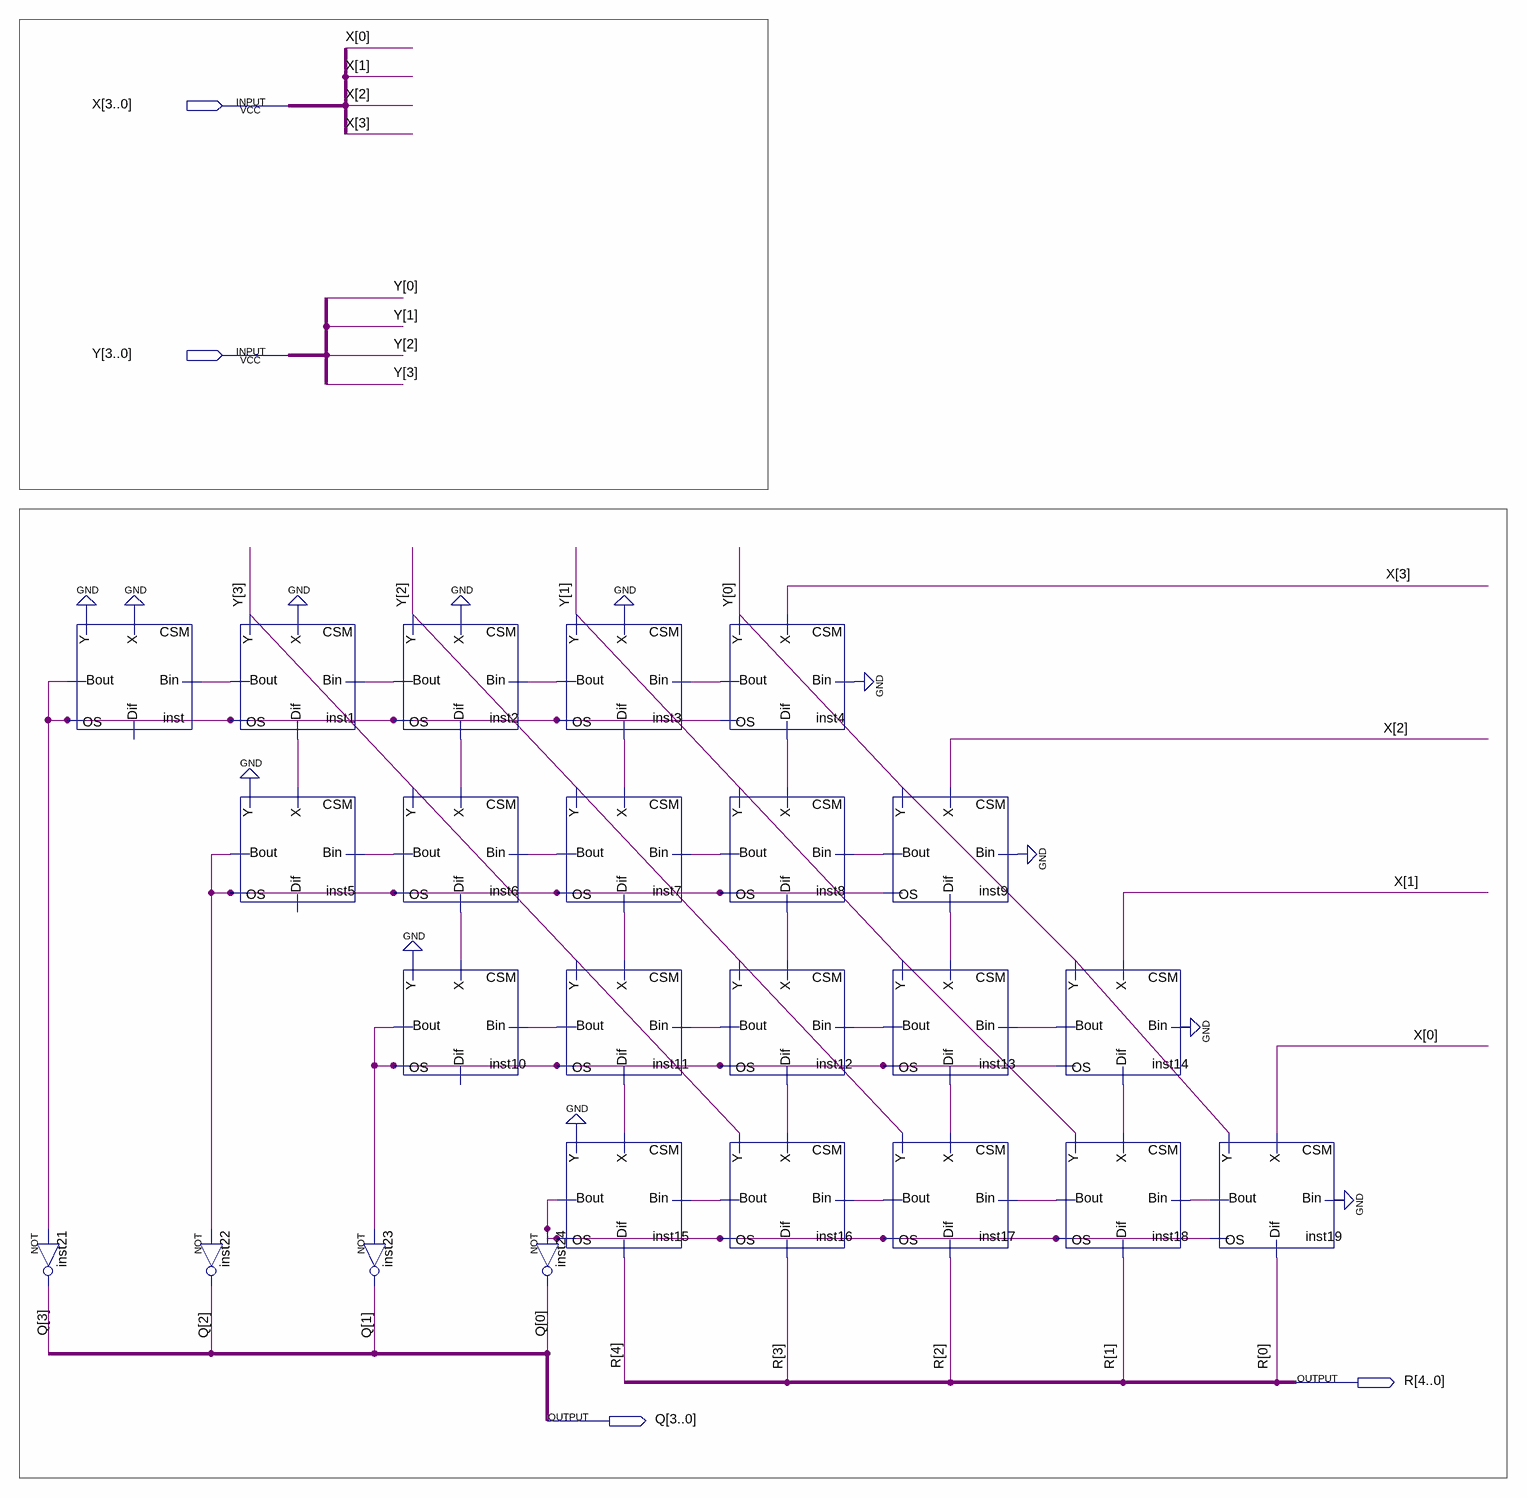
[diagram p0: schematic sheet]
// Quartus schematic divisor.bdf as structural Verilog: 24 symbols, 4 pins
module divisor (
  input  [3:0] X,
  input  [3:0] Y,
  output [4:0] R,
  output [3:0] Q
);

  wire inst1_bout, inst1_dif, inst2_bout, inst2_dif, inst3_bout, inst3_dif, inst4_bout, inst4_dif,
       inst5_bout, inst6_bout, inst6_dif, inst7_bout, inst7_dif, inst8_bout, inst8_dif, inst9_bout,
       inst9_dif, inst10_bout, inst11_bout, inst11_dif, inst12_bout, inst12_dif, inst13_bout, inst13_dif,
       inst14_bout, inst14_dif, inst15_bout, inst16_bout, inst17_bout, inst18_bout, inst19_bout, inst_bout;

  not inst21 (Q[3], inst_bout);
  CSM inst (.Y(1'b0), .X(1'b0), .Bin(inst1_bout), .OS(inst_bout), .Bout(inst_bout));  // open: Dif
  not inst22 (Q[2], inst5_bout);
  CSM inst1 (.Y(Y[3]), .X(1'b0), .Bin(inst2_bout), .OS(inst_bout), .Bout(inst1_bout), .Dif(inst1_dif));
  CSM inst5 (.Y(1'b0), .X(inst1_dif), .Bin(inst6_bout), .OS(inst5_bout), .Bout(inst5_bout));  // open: Dif
  not inst23 (Q[1], inst10_bout);
  CSM inst2 (.Y(Y[2]), .X(1'b0), .Bin(inst3_bout), .OS(inst_bout), .Bout(inst2_bout), .Dif(inst2_dif));
  CSM inst6 (.Y(Y[3]), .X(inst2_dif), .Bin(inst7_bout), .OS(inst5_bout), .Bout(inst6_bout), .Dif(inst6_dif));
  CSM inst10 (.Y(1'b0), .X(inst6_dif), .Bin(inst11_bout), .OS(inst10_bout), .Bout(inst10_bout));  // open: Dif
  CSM inst3 (.Y(Y[1]), .X(1'b0), .Bin(inst4_bout), .OS(inst_bout), .Bout(inst3_bout), .Dif(inst3_dif));
  CSM inst7 (.Y(Y[2]), .X(inst3_dif), .Bin(inst8_bout), .OS(inst5_bout), .Bout(inst7_bout), .Dif(inst7_dif));
  CSM inst11 (.Y(Y[3]), .X(inst7_dif), .Bin(inst12_bout), .OS(inst10_bout), .Bout(inst11_bout), .Dif(inst11_dif));
  CSM inst15 (.Y(1'b0), .X(inst11_dif), .Bin(inst16_bout), .OS(inst15_bout), .Bout(inst15_bout), .Dif(R[4]));
  not inst24 (Q[0], inst15_bout);
  CSM inst4 (.Y(Y[0]), .X(X[3]), .Bin(1'b0), .OS(inst_bout), .Bout(inst4_bout), .Dif(inst4_dif));
  CSM inst8 (.Y(Y[1]), .X(inst4_dif), .Bin(inst9_bout), .OS(inst5_bout), .Bout(inst8_bout), .Dif(inst8_dif));
  CSM inst12 (.Y(Y[2]), .X(inst8_dif), .Bin(inst13_bout), .OS(inst10_bout), .Bout(inst12_bout), .Dif(inst12_dif));
  CSM inst16 (.Y(Y[3]), .X(inst12_dif), .Bin(inst17_bout), .OS(inst15_bout), .Bout(inst16_bout), .Dif(R[3]));
  CSM inst9 (.Y(Y[0]), .X(X[2]), .Bin(1'b0), .OS(inst5_bout), .Bout(inst9_bout), .Dif(inst9_dif));
  CSM inst13 (.Y(Y[1]), .X(inst9_dif), .Bin(inst14_bout), .OS(inst10_bout), .Bout(inst13_bout), .Dif(inst13_dif));
  CSM inst17 (.Y(Y[2]), .X(inst13_dif), .Bin(inst18_bout), .OS(inst15_bout), .Bout(inst17_bout), .Dif(R[2]));
  CSM inst14 (.Y(Y[0]), .X(X[1]), .Bin(1'b0), .OS(inst10_bout), .Bout(inst14_bout), .Dif(inst14_dif));
  CSM inst18 (.Y(Y[1]), .X(inst14_dif), .Bin(inst19_bout), .OS(inst15_bout), .Bout(inst18_bout), .Dif(R[1]));
  CSM inst19 (.Y(Y[0]), .X(X[0]), .Bin(1'b0), .OS(inst15_bout), .Bout(inst19_bout), .Dif(R[0]));
endmodule
